# Altium schematic sheet Stepper.SchDoc
size A
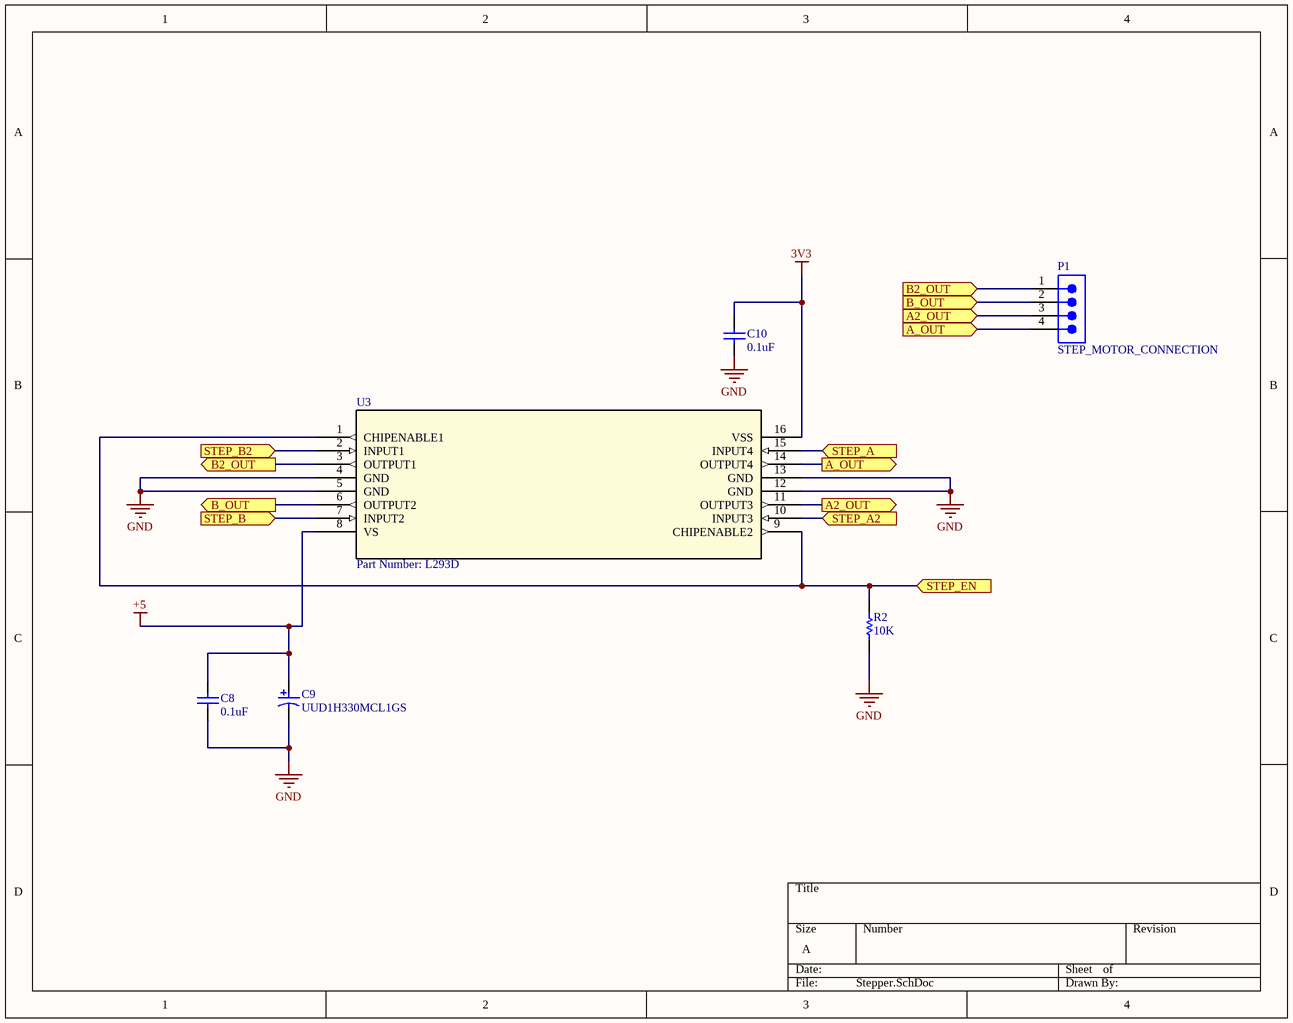
[diagram p0: Stepper.SchDoc]

## Parts
C8  0.1uF  [CAPC1608X90X35LL15T15]
C9  UUD1H330MCL1GS  [NIC-CAPA2-6.3X7.7_V]
C10  0.1uF  [CAPC1608X90X35LL15T15]
P1  STEP_MOTOR_CONNECTION  [SMTC-TSW-104-08-X-S]
R2  10K  [RESC1609X50X30ML10T20]
U3  Part Number: L293D  [PowerDIP-16]

## Ports
A2_OUT (in), A2_OUT (out), A_OUT (in), A_OUT (out), B2_OUT (in), B2_OUT (out), B_OUT (in), B_OUT (out), STEP_A2 (in), STEP_A (in), STEP_B2 (in), STEP_B (in), STEP_EN (in)

## Nets
3V3: C10.2 U3.16(VSS)
+5: C8.2 C9.1 U3.8(VS)
GND: C8.1 C9.2 C10.1 R2.1 U3.4(GND) U3.5(GND) U3.12(GND) U3.13(GND)
A2_OUT: P1.3 U3.11(OUTPUT3) ; port A2_OUT
A_OUT: P1.4 U3.14(OUTPUT4) ; port A_OUT
B2_OUT: P1.1 U3.3(OUTPUT1) ; port B2_OUT
B_OUT: P1.2 U3.6(OUTPUT2) ; port B_OUT
STEP_A: U3.15(INPUT4) ; port STEP_A
STEP_A2: U3.10(INPUT3) ; port STEP_A2
STEP_B: U3.7(INPUT2) ; port STEP_B
STEP_B2: U3.2(INPUT1) ; port STEP_B2
STEP_EN: R2.2 U3.1(CHIPENABLE1) U3.9(CHIPENABLE2) ; port STEP_EN

## Library data of the parts
C8 C10 = CMP-2006-04389-2: Chip Capacitor, 100 nF, +/- 10%, 50 V, -55 to 125 degC, 0603 (1608 Metric), RoHS, Tape and Reel; Case\Package: 0603; Type (Capacitors): X7R; Capacitance: 100 nF; Voltage Rating: 50 V; Pins: 2; Max Operating Temperature: 125 degC; Min Operating Temperature: -55 degC; Case Code (Imperial): 0603; DatasheetVersion: 07/2016; Package Quantity: 4000; Length: 1.6 mm; REACH SVHC: No SVHC; Packaging: Tape and Reel; Case Code (Metric): 1608; Mounting Technology: Surface Mount; RoHSCompliant: true; Height: 0.9 mm; ComponentLink1URL: http://www.avx.com/; ComponentLink2URL: http://datasheets.avx.com/X7RDielectric.pdf; Mount: Surface Mount; ComponentLink2Description: Datasheet; Width: 0.81 mm; PackageReference: 0603; PackageDescription: 2-Pin Surface Mount Device, Body 1.6 x 0.81 mm; Radiation Hardening: No; ComponentLink1Description: Manufacturer URL; Voltage Rating (DC): 50 V; Tolerance: 10%
C9 = CMP-0687-00057-1: Aluminum Electrolytic Capacitor, UD Series, Low Impedance, 33 uF, 50 V, + / - 20%, -55 to 105 degC, Chip Type, 6.3 x 7.7 mm D x L, Pb-Free, Reel; Manufacturer: Nichicon; Endurance Time: 2000 h; Rated Voltage: 50 V; Rated Ripple Current (at 100kHz): 185 mA; Packing: Dia382mm Reel; Tolerance Rated Capacitance: -20 to 20%; Rated Capacitance: 33 uF; Impedance: 0.68 Ohm; Mounting Technology: Surface Mount; PartNumber: UUD1H330MCL1GS; DatasheetVersion: 08/2012; PackageReference: CAPAE-D6.3H7.7; ComponentLink1Description: Manufacturer URL; ComponentLink1URL: http://www.nichicon.co.jp/; Length: 7.7 mm; PackageDescription: 2-Pin Surface Mount Device, Diameter 6.3 mm, Height 7.7 mm, Pitch 5.4 mm; Diameter: 6.3 mm; ComponentLink3Description: Package Specification; RoHS: TRUE; ComponentLink2Description: Datasheet; ComponentLink2URL: http://products.nichicon.co.jp/en/pdf/XJA043/e-ud.pdf; ComponentLink3URL: http://products.nichicon.co.jp/en/pdf/XJA043/e-ud.pdf
P1 = CMP-1024-00358-1: 0.025" SQ Post Header, Through-hole, Vertical, -55 to 125 degC, 2.54 mm Pitch, 4-Pin, Male, RoHS; PartNumber: TSW-104-08-L-S; Manufacturer: Samtec; Pitch: 2.54 mm; RoHS: True; Temperature Range: -55 to 125 degC; PackageDescription: .025[0.64] SQ. Post Terminal Strip Assembly; Orientation: Vertical; ComponentLink2URL: http://www.samtec.com/documents/webfiles/pdf/TSW_TH.PDF; ComponentLink1Description: Manufacturer URL; ComponentLink2Description: Datasheet; PackageVersion: DM, 8/1988; ComponentLink3URL: http://www.samtec.com/documents/webfiles/cpdf/TSW-XXX-XX-XXX-X-XX-XXX-MKT.pdf; Mounting Technology: Through-hole; PackageReference: TSW-104-08-X-S; ComponentLink3Description: Package Specification; ComponentLink1URL: http://www.samtec.com; DatasheetVersion: F-214
R2 = CMP-2000-03838-1: Manufacturer: Vishay Dale; Part Number: CRCW060310K0JNEA
U3 = L293D: No Description Available; Vendor: STMicroelectronics; Built_By: EMA_UL_Team; Manufacturer_Part_Number: L293D; Copyright: Copyright (C) 2018 Accelerated Designs. All rights reserved; RefDes: RefDes; Type: DEV; Value: Value